# Altium schematic sheet MCU_STM32F427ZGT6.SchDoc
size B; DrawnBy: M.Rex; Engineer: MR; Organization: Expatria Technologies; Address1: 1136 Glade Court; Address2: Port Coquitlam, BC V3B 1R5; Address3: CANADA
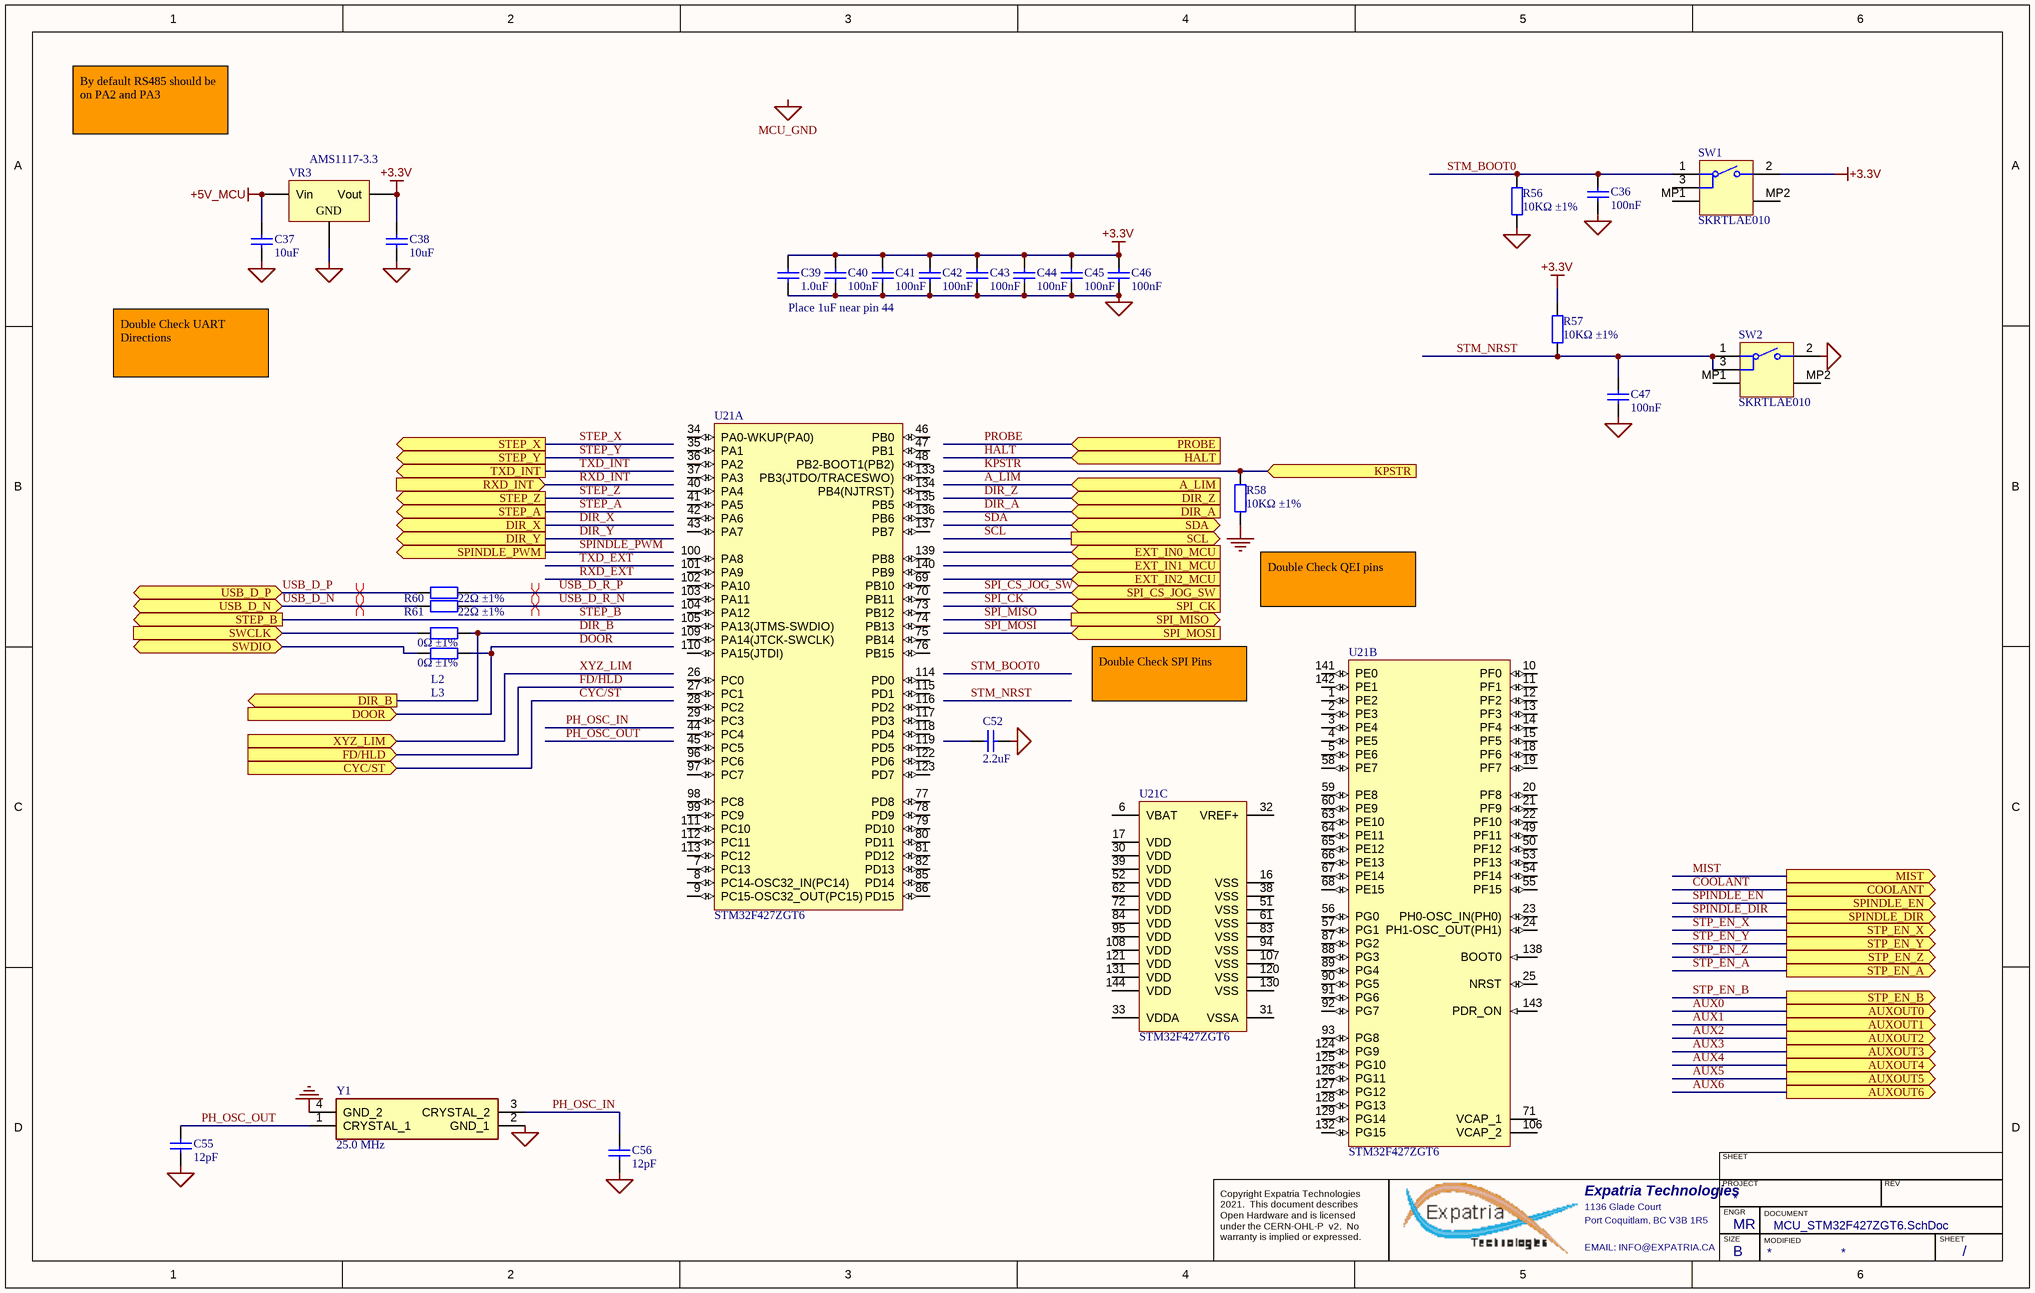
[diagram p0: MCU_STM32F427ZGT6.SchDoc]

## Parts
C36  100nF  [0402_C]
C37  10uF  [1206_C]
C38  10uF  [1206_C]
C39  1.0uF  [0402_C]
C40  100nF  [0402_C]
C41  100nF  [0402_C]
C42  100nF  [0402_C]
C43  100nF  [0402_C]
C44  100nF  [0402_C]
C45  100nF  [0402_C]
C46  100nF  [0402_C]
C47  100nF  [0402_C]
C52  2.2uF  [0603_C]
C55  12pF  [0402_C]
C56  12pF  [0402_C]
L2  0Ω ±1%  [0402_R]
L3  0Ω ±1%  [0402_R]
R56  10KΩ ±1%  [0402_R]
R57  10KΩ ±1%  [0402_R]
R58  10KΩ ±1%  [0402_R]
R60  22Ω ±1%  [0402_R]
R61  22Ω ±1%  [0402_R]
SW1  SKRTLAE010  [ALPS-SKRTLAE010_V]
SW2  SKRTLAE010  [ALPS-SKRTLAE010_V]
U21  STM32F427ZGT6  [STM-LQFP144_V]  (parts A,B,C of 3)
VR3  AMS1117-3.3  [SOT-223]
Y1  25.0 MHz  [YSX321SL]

## Ports
A_LIM (in), AUXOUT0 (out), AUXOUT1 (out), AUXOUT2 (out), AUXOUT3 (out), AUXOUT4 (out), AUXOUT5 (out), AUXOUT6 (out), COOLANT (out), CYC/ST (in), DIR_A (in), DIR_B (out), DIR_X (out), DIR_Y (out), DIR_Z (in), DOOR (in), EXT_IN0_MCU (in), EXT_IN1_MCU (in), EXT_IN2_MCU (in), FD/HLD (in), HALT (in), KPSTR (in), MIST (out), PROBE (in), RXD_INT (in), SCL (out), SDA (bidir), SPI_CK (in), SPI_CS_JOG_SW (in), SPI_MISO (out), SPI_MOSI (in), SPINDLE_DIR (out), SPINDLE_EN (out), SPINDLE_PWM (out), STEP_A (out), STEP_B (out), STEP_X (out), STEP_Y (out), STEP_Z (out), STP_EN_A (out), STP_EN_B (out), STP_EN_X (out), STP_EN_Y (out), STP_EN_Z (out), SWCLK (in), SWDIO (bidir), TXD_INT (out), USB_D_N (bidir), USB_D_P (bidir), XYZ_LIM (in)

## Nets
+3.3V: C38.2 C39.2 C40.2 C41.2 C42.2 C43.2 C44.2 C45.2 C46.2 R57.1 SW1.2 VR3.2(Vout)
+5V_MCU: C37.2 VR3.3(Vin)
GND: R58.1 Y1.4(GND_2)
MCU_GND: C36.1 C37.1 C38.1 C39.1 C40.1 C41.1 C42.1 C43.1 C44.1 C45.1 C46.1 C47.1 C52.1 C55.1 C56.1 R56.2 SW2.2 VR3.1(GND) Y1.2(GND_1)
A_LIM: port A_LIM
AUX0: port AUXOUT0
AUX1: port AUXOUT1
AUX2: port AUXOUT2
AUX3: port AUXOUT3
AUX4: port AUXOUT4
AUX5: port AUXOUT5
AUX6: port AUXOUT6
COOLANT: port COOLANT
CYC/ST: port CYC/ST
DIR_A: port DIR_A
DIR_B: L2.2 ; port DIR_B
DIR_X: port DIR_X
DIR_Y: port DIR_Y
DIR_Z: port DIR_Z
DOOR: L3.2 ; port DOOR
FD/HLD: port FD/HLD
HALT: port HALT
KPSTR: R58.2 ; port KPSTR
MIST: port MIST
PH_OSC_IN: C56.2 Y1.3(CRYSTAL_2)
PH_OSC_OUT: C55.2 Y1.1(CRYSTAL_1)
PROBE: port PROBE
RXD_INT: port RXD_INT
SCL: port SCL
SDA: port SDA
SPI_CK: port SPI_CK
SPI_CS_JOG_SW: port SPI_CS_JOG_SW
SPI_MISO: port SPI_MISO
SPI_MOSI: port SPI_MOSI
SPINDLE_DIR: port SPINDLE_DIR
SPINDLE_EN: port SPINDLE_EN
SPINDLE_PWM: port SPINDLE_PWM
STEP_A: port STEP_A
STEP_B: port STEP_B
STEP_X: port STEP_X
STEP_Y: port STEP_Y
STEP_Z: port STEP_Z
STM_BOOT0: C36.2 R56.1 SW1.1
STM_NRST: C47.2 R57.2 SW2.1 SW2.3
STP_EN_A: port STP_EN_A
STP_EN_B: port STP_EN_B
STP_EN_X: port STP_EN_X
STP_EN_Y: port STP_EN_Y
STP_EN_Z: port STP_EN_Z
SWCLK: L2.1 ; port SWCLK
SWDIO: L3.1 ; port SWDIO
TXD_INT: port TXD_INT
USB_D_N: R61.2 ; port USB_D_N
USB_D_P: R60.2 ; port USB_D_P
USB_D_R_N: R61.1
USB_D_R_P: R60.1
XYZ_LIM: port XYZ_LIM

Not connected (* = marked no-connect by the designer): C52 2; SW1 3 MP1 MP2; SW2 MP1 MP2; U21 1(PE2) 2(PE3) 3(PE4) 4(PE5) 5(PE6) 6(VBAT) 7(PC13) 8(PC14-OSC32_IN(PC14)) 9(PC15-OSC32_OUT(PC15)) 10(PF0) 11(PF1) 12(PF2) 13(PF3) 14(PF4) 15(PF5) 16(VSS) 17(VDD) 18(PF6) 19(PF7) 20(PF8) 21(PF9) 22(PF10) 23(PH0-OSC_IN(PH0)) 24(PH1-OSC_OUT(PH1)) 25(NRST) 26(PC0) 27(PC1) 28(PC2) 29(PC3) 30(VDD) 31(VSSA) 32(VREF+) 33(VDDA) 34(PA0-WKUP(PA0)) 35(PA1) 36(PA2) 37(PA3) 38(VSS) 39(VDD) 40(PA4) 41(PA5) 42(PA6) 43(PA7) 44(PC4) 45(PC5) 46(PB0) 47(PB1) 48(PB2-BOOT1(PB2)) 49(PF11) 50(PF12) 51(VSS) 52(VDD) 53(PF13) 54(PF14) 55(PF15) 56(PG0) 57(PG1) 58(PE7) 59(PE8) 60(PE9) 61(VSS) 62(VDD) 63(PE10) 64(PE11) 65(PE12) 66(PE13) 67(PE14) 68(PE15) 69(PB10) 70(PB11) 71(VCAP_1) 72(VDD) 73(PB12) 74(PB13) 75(PB14) 76(PB15) 77(PD8) 78(PD9) 79(PD10) 80(PD11) 81(PD12) 82(PD13) 83(VSS) 84(VDD) 85(PD14) 86(PD15) 87(PG2) 88(PG3) 89(PG4) 90(PG5) 91(PG6) 92(PG7) 93(PG8) 94(VSS) 95(VDD) 96(PC6) 97(PC7) 98(PC8) 99(PC9) 100(PA8) 101(PA9) 102(PA10) 103(PA11) 104(PA12) 105(PA13(JTMS-SWDIO)) 106(VCAP_2) 107(VSS) 108(VDD) 109(PA14(JTCK-SWCLK)) 110(PA15(JTDI)) 111(PC10) 112(PC11) 113(PC12) 114(PD0) 115(PD1) 116(PD2) 117(PD3) 118(PD4) 119(PD5) 120(VSS) 121(VDD) 122(PD6) 123(PD7) 124(PG9) 125(PG10) 126(PG11) 127(PG12) 128(PG13) 129(PG14) 130(VSS) 131(VDD) 132(PG15) 133(PB3(JTDO/TRACESWO)) 134(PB4(NJTRST)) 135(PB5) 136(PB6) 137(PB7) 138(BOOT0) 139(PB8) 140(PB9) 141(PE0) 142(PE1) 143(PDR_ON) 144(VDD)

## Layout directives
differential pair: USB_D_N, USB_D_P, USB_D_R_N, USB_D_R_P

## Notes on the sheet
- By default RS485 should be on PA2 and PA3
- Double Check UART Directions
- Place 1uF near pin 44
- Double Check QEI pins
- Double Check SPI Pins
- Labels drawn without touching a wire or pin: MCU_GND
- SHEET
- Expatria Technologies
- 1136 Glade Court
- Port Coquitlam, BC V3B 1R5
- PROJECT
- SIZE
- ENGR
- MODIFIED
- DOCUMENT
- REV
- Copyright Expatria Technologies 2021.  This document describes Open Hardware and is licensed under the CERN-OHL-P  v2.  No warranty is implied or expressed.
- EMAIL: INFO@EXPATRIA.CA
- B
- /

## Library data of the parts
C36 C40-C47 = 0402 100nF (104) 10% 16V: Chip capacitors; Manufacturer: Samsung Electro-Mechanics; PartNumber: CL05B104KO5NNNC; Tolerance: 10%; Voltage: 16V; ComponentLink1Description: Supplier link; ComponentLink1URL: http://www.szlcsc.com/product/details_1877.html; Package: 0402; Supplier: LC; SuppliersPartNumber: C1525; Capacitance: 100nF
C37 C38 = 1206 10uF (106) 10% 50V: Chip capacitors; Manufacturer: Samsung Electro-Mechanics; PartNumber: CL31A106KBHNNNE; Tolerance: 10%; Voltage: 50V; ComponentLink1Description: Supplier link; ComponentLink1URL: http://www.szlcsc.com/product/details_14236.html; Package: 1206; Supplier: LC; SuppliersPartNumber: C13585; Capacitance: 10uF
C39 = 0402 1.0uF (105) 10% 25V: Chip capacitor; Manufacturer: Samsung Electro-Mechanics; PartNumber: CL05A105KA5NQNC; Capacitance: 1uF; Tolerance: 10%; Voltage: 25V; ComponentLink1Description: Supplier link; ComponentLink1URL: http://www.szlcsc.com/product/details_53938.html; Package: 0402; Supplier: LC; SuppliersPartNumber: C52923
C52 = 0603 2.2uF (225) 10% 16V: Chip capacitors; Manufacturer: Samsung Electro-Mechanics; PartNumber: CL10A225KO8NNNC; Tolerance: 10%; Voltage: 16V; ComponentLink1Description: Supplier link; ComponentLink1URL: http://www.szlcsc.com/product/details_24366.html; Package: 0603; Supplier: LC; SuppliersPartNumber: C23630; Capacitance: 2.2uF
C55 C56 = 0402 12pF (120) 5% 50V: Chip capacitors; Manufacturer: Guangdong Fenghua Advanced Tech; PartNumber: 0402CG120J500NT; Tolerance: 5%; Voltage: 50V; ComponentLink1Description: Supplier link; ComponentLink1URL: http://www.szlcsc.com/product/details_1899.html; Package: 0402; Supplier: LC; SuppliersPartNumber: C1547; Capacitance: 12pF
L2 L3 = 0402 0R (0R0) 1%: Chip resistor; Manufacturer: Uniroyal Elec; PartNumber: 0402WGF0000TCE; Power: 1/16W; Package: 0402; Supplier: LC; SuppliersPartNumber: C17168; ComponentLink1Description: Supplier link; ComponentLink1URL: http://www.szlcsc.com/product/details_17853.html; Resistance: 0Ω; Tolerance: 1%
R56-R58 = 0402 10K (1002) 1%: Chip resistor; Manufacturer: Uniroyal Elec; PartNumber: 0402WGF1002TCE; Power: 1/16W; ComponentLink1Description: Supplier link; ComponentLink1URL: http://www.szlcsc.com/product/details_26487.html; Package: 0402; Supplier: LC; SuppliersPartNumber: C25744; Resistance: 10KΩ; Tolerance: 1%
R60 R61 = 0402 22R (22R0) 1%: Chip resistor; Manufacturer: Uniroyal Elec; PartNumber: 0402WGF220JTCE; Power: 1/16W; ComponentLink1Description: Supplier link; ComponentLink1URL: http://www.szlcsc.com/product/details_25835.html; Package: 0402; Supplier: LC; SuppliersPartNumber: C25092; Resistance: 22Ω; Tolerance: 1%
SW1 SW2 = CMP-2000-07073-2: Side Push Type, 250 V, -40 to 90 degC, 3-Pin SMD, RoHS, Tape and Reel; Manufacturer: ALPS; Operating Force: 1.6N; Folder: Unified Components\Components\New Releases\New\; Maximum Current Rating: 0.05@12VDCA; RevisionId: 1; Pole Throw Configuration: SPST; Switch Configuration: N.O.; AccessRights: 2147483647; Maximum DC Voltage Rating: 12V; ContentType: Unified Component; Rad Hard: No; Mounting: SurfaceMount; Datasheet URL: http://www.alps.com/prod/info/E/PDF/Tact/SurfaceMount/SKRT/SKRT.PDF; Manufacturer URL: http://www.alps.com/e/; ReleaseDate: 22/09/2017 06:13:25 AM; ItemHRID: CMP-2000-07073; ContentTypeGUID: CB3C11C4-E317-11DF-B822-12313F0024A2; LifeCycle: Released; ItemGUID: EAC55BEC-37DC-4BDB-8BA7-D75E6D5C3D75; Packaging: Tape&Reel; Package Reference: SKRTLAE010; FolderGUID: B7F4506A-9127-42E7-A087-46FE7B18D116; Datasheet Version: 06/2015; Mounting Technology: SurfaceMount; LifeCycleStateGUID: 61E382EE-6656-4F12-9E24-BE9327104A25; Package Description: 3-Pin Surface Mount Device, Body 4.5 x 3.55 mm, Pitch 1.225 mm; SuppliersPartNumber: C110293
U21 = CMP-0243-00054-2: ARM Cortex-M4 32-bit MCU+FPU, 210 DMIPS, 1024 kB Flash, 256 kB Internal RAM, 114 I/Os, 144-pin LQFP, -40 to 85 degC, Tray; Manufacturer: STMicroelectronics; I/Os (High Current): 114; Supply Voltage(Vcc) max (V): 3.6; FLASH Size (Prog) (kB): 1024; Supply Voltage(Vcc) min (V): 1.8; Internal RAM Size (kB): 256; D/A Converter: 2x12-bit; Operating Frequency(F) (Processor speed) (MHz): 168; Packing: Tray; ComponentLink2URL: http://www.st.com/st-web-ui/static/active/en/resource/technical/document/datasheet/DM00071990.pdf; ComponentLink2Description: Datasheet; ComponentLink3URL: http://www.st.com/st-web-ui/static/active/en/resource/technical/document/datasheet/DM00037051.pdf; ComponentLink1Description: Manufacturer URL; PackageReference: LQFP144; Core: ARM Cortex-M4; ComponentLink1URL: http://www.st.com/web/en/home.html; PackageDescription: 144-Pin Low Profile Quad Flat Package, 20 x 20 mm Body, 0.5 mm Pitch; Mounting Technology: Surface Mount; ComponentLink3Description: Package Specification; PackageVersion: Rev. 4, 06/2013; DatasheetVersion: Rev. 1; PartNumber: STM32F427ZGT6
VR3 = SOT-223 AMS1117-3.3: 低压差线性稳压(LDO); ComponentLink1Description: 供应商链接; ComponentLink1URL: http://www.szlcsc.com/product/details_6652.html; Package: SOT-223; Supplier: LC; SuppliersPartNumber: C6186
Y1 = YSX321SL: Crystal or Oscillator; Manufacturer_Name: Yangxing Tech; Manufacturer_Part_Number: X322525MSB4SI; Height: 0.8mm; SuppliersPartNumber: C13740